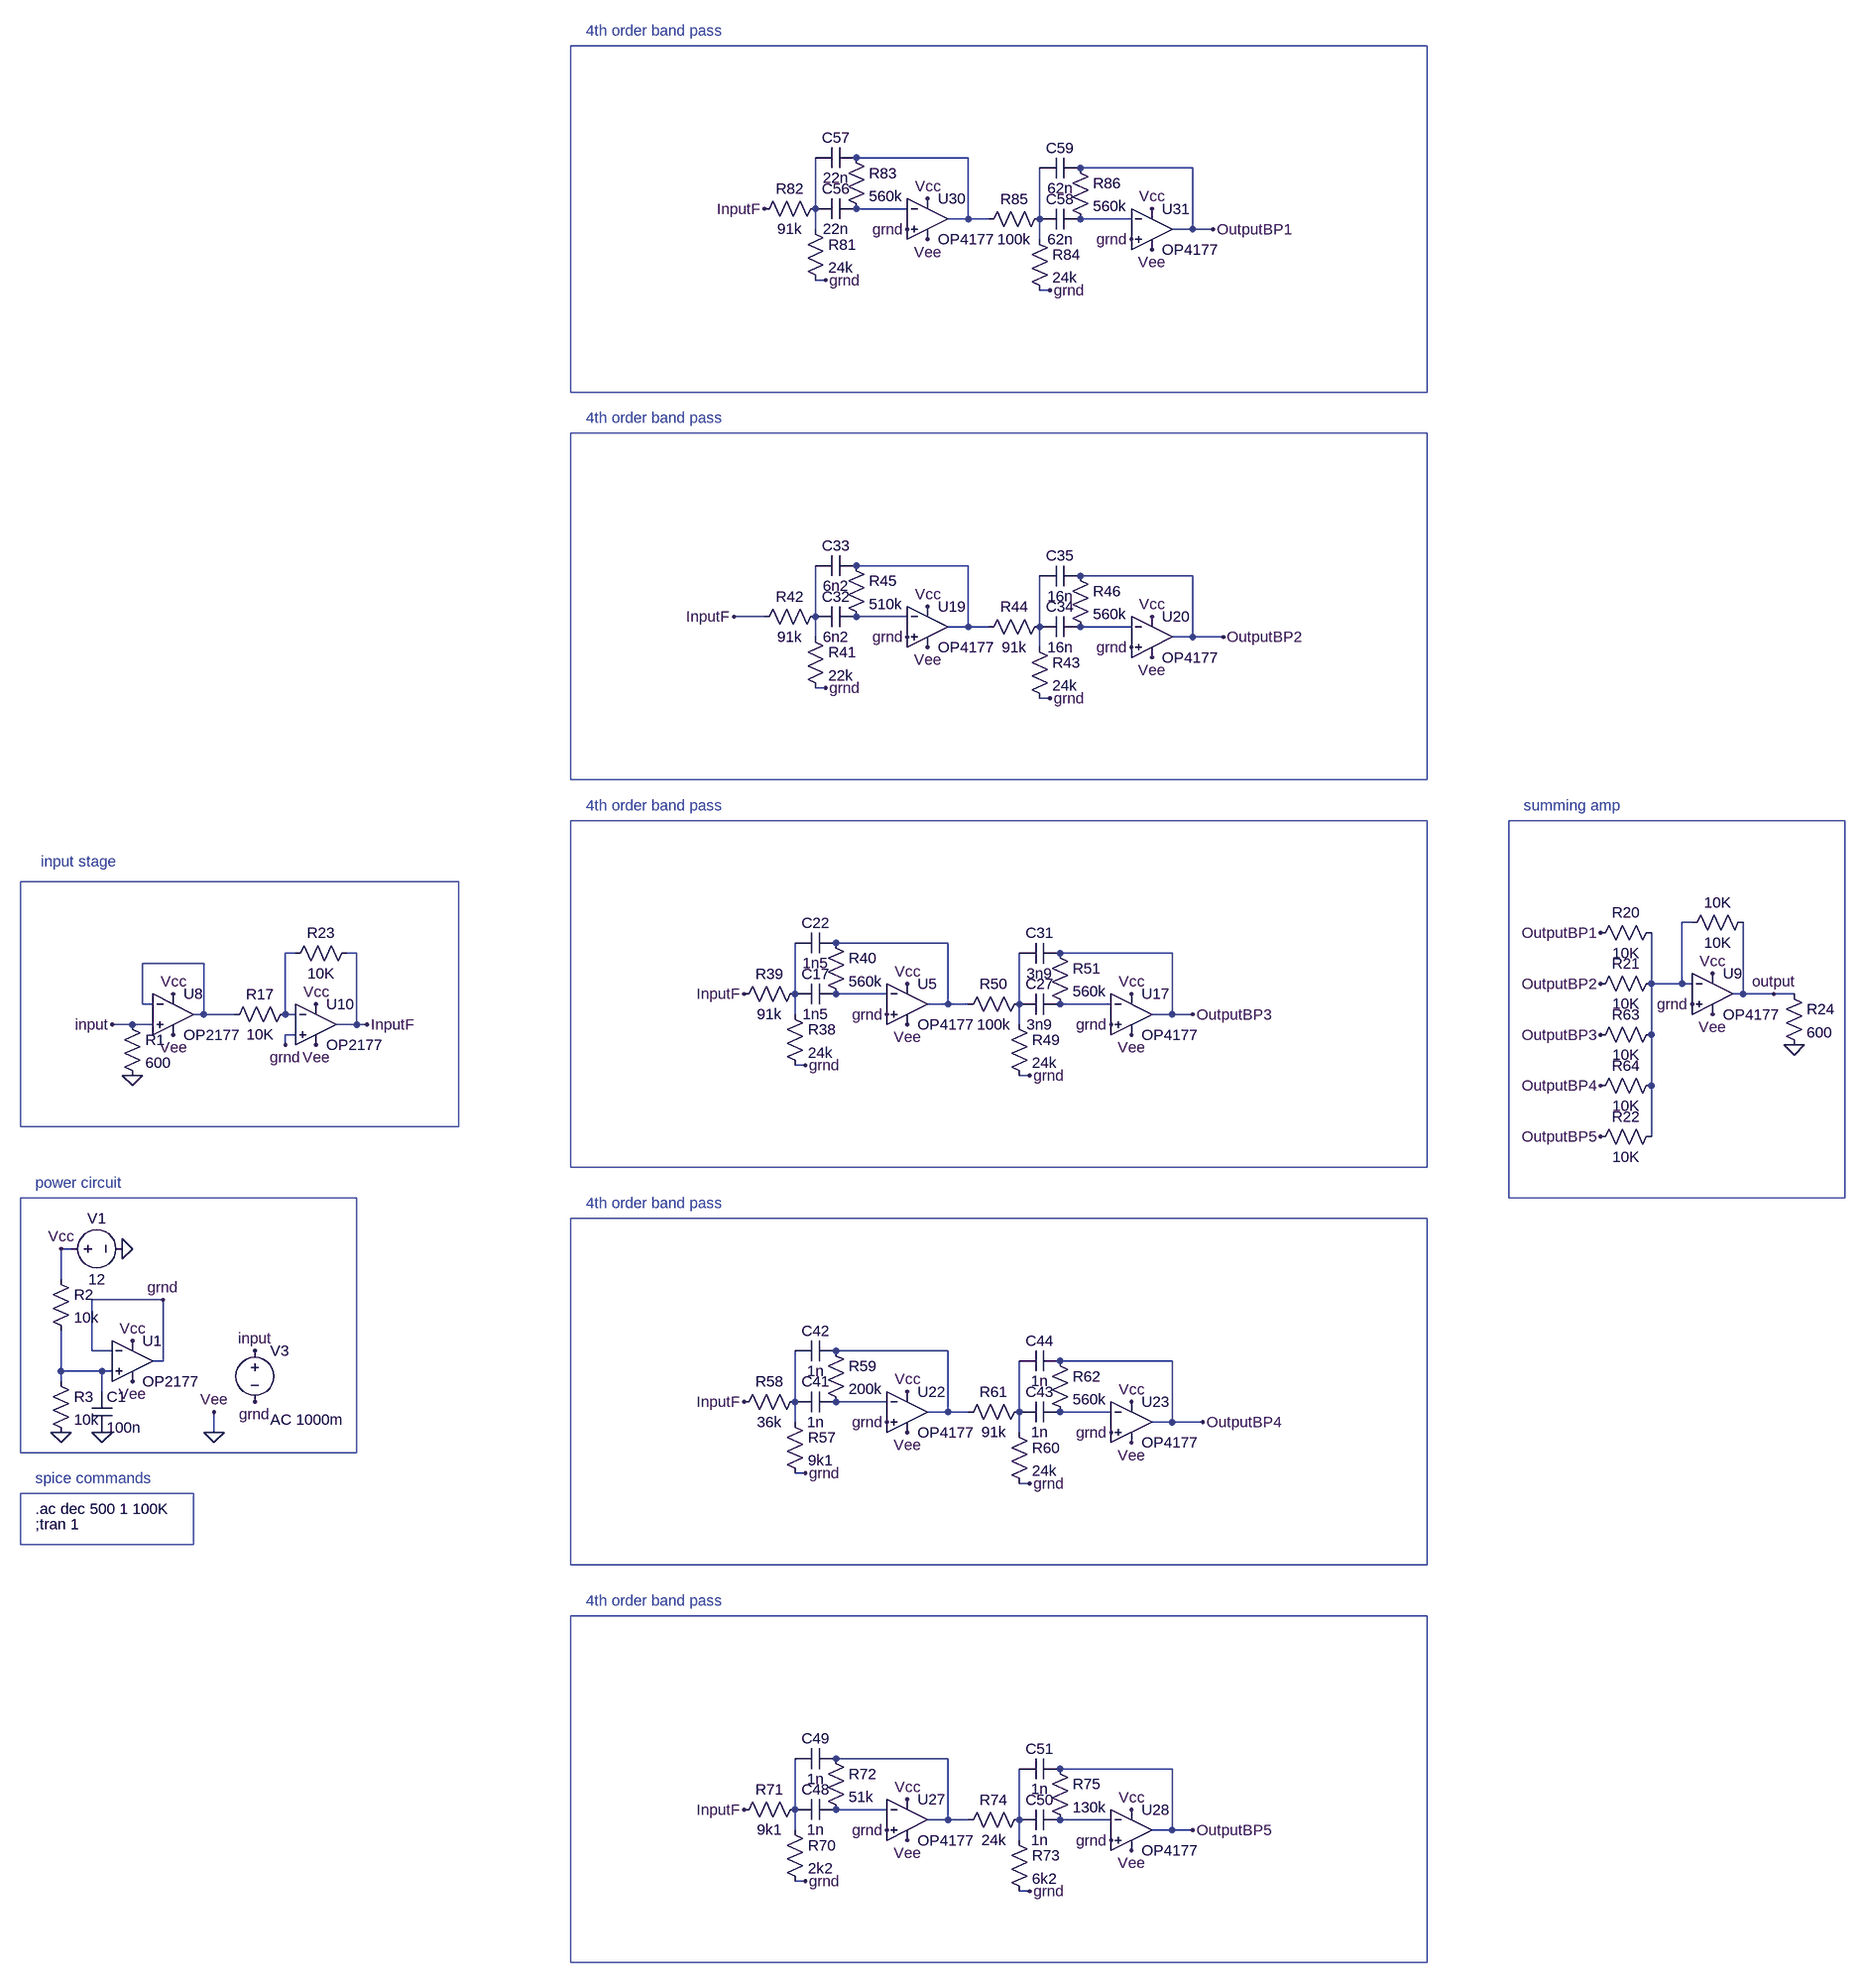
[diagram p0: schematic Filter+in&outputstage.asc]
Filter+in&outputstage.asc, the LTspice schematic file:
Version 4
SHEET 1 4112 3308
WIRE 752 -1120 576 -1120
WIRE 1104 -1104 928 -1104
WIRE 512 -1040 512 -1120
WIRE 656 -1040 576 -1040
WIRE 752 -1024 752 -1120
WIRE 752 -1024 720 -1024
WIRE 784 -1024 752 -1024
WIRE 864 -1024 864 -1104
WIRE 1008 -1024 928 -1024
WIRE 512 -1008 512 -1040
WIRE 1104 -1008 1104 -1104
WIRE 1104 -1008 1072 -1008
WIRE 1136 -1008 1104 -1008
WIRE 864 -992 864 -1024
WIRE 528 -928 512 -928
WIRE 880 -912 864 -912
WIRE 752 -480 576 -480
WIRE 1104 -464 928 -464
WIRE 432 -400 384 -400
WIRE 512 -400 512 -480
WIRE 656 -400 576 -400
WIRE 752 -384 752 -480
WIRE 752 -384 720 -384
WIRE 784 -384 752 -384
WIRE 864 -384 864 -464
WIRE 1008 -384 928 -384
WIRE 512 -368 512 -400
WIRE 1104 -368 1104 -464
WIRE 1104 -368 1072 -368
WIRE 1152 -368 1104 -368
WIRE 864 -352 864 -384
WIRE 528 -288 512 -288
WIRE 880 -272 864 -272
WIRE 1888 80 1872 80
WIRE 720 112 544 112
WIRE -304 128 -320 128
WIRE -208 128 -224 128
WIRE 1072 128 896 128
WIRE -448 144 -544 144
WIRE 1824 176 1824 96
WIRE 1872 176 1872 80
WIRE 1872 176 1824 176
WIRE 1888 176 1872 176
WIRE 480 192 480 112
WIRE 624 192 544 192
WIRE 1968 192 1968 80
WIRE 1968 192 1952 192
WIRE 2016 192 1968 192
WIRE 2048 192 2016 192
WIRE -544 208 -544 144
WIRE -528 208 -544 208
WIRE 720 208 720 112
WIRE 720 208 688 208
WIRE 752 208 720 208
WIRE 832 208 832 128
WIRE 976 208 896 208
WIRE -448 224 -448 144
WIRE -448 224 -464 224
WIRE -400 224 -448 224
WIRE -320 224 -320 128
WIRE -304 224 -320 224
WIRE 480 224 480 192
WIRE 1072 224 1072 128
WIRE 1072 224 1040 224
WIRE 1104 224 1072 224
WIRE -560 240 -592 240
WIRE -528 240 -560 240
WIRE -208 240 -208 128
WIRE -208 240 -240 240
WIRE -192 240 -208 240
WIRE 832 240 832 208
WIRE -304 256 -320 256
WIRE 1824 256 1824 176
WIRE -320 272 -320 256
WIRE 496 304 480 304
WIRE 848 320 832 320
WIRE 1824 336 1824 256
WIRE 1824 416 1824 336
WIRE -656 592 -672 592
WIRE -672 640 -672 592
WIRE -512 672 -624 672
WIRE -624 752 -624 672
WIRE -592 752 -624 752
WIRE 720 752 544 752
WIRE -512 768 -512 672
WIRE -512 768 -528 768
WIRE 1072 768 896 768
WIRE -672 784 -672 720
WIRE -608 784 -672 784
WIRE -592 784 -608 784
WIRE -672 800 -672 784
WIRE -608 816 -608 784
WIRE 480 832 480 752
WIRE 624 832 544 832
WIRE 720 848 720 752
WIRE 720 848 688 848
WIRE 752 848 720 848
WIRE 832 848 832 768
WIRE 976 848 896 848
WIRE 480 864 480 832
WIRE 1072 864 1072 768
WIRE 1072 864 1040 864
WIRE 1120 864 1072 864
WIRE -432 880 -432 848
WIRE 832 880 832 848
WIRE 496 944 480 944
WIRE 848 960 832 960
WIRE 720 1392 544 1392
WIRE 1072 1408 896 1408
WIRE 480 1472 480 1392
WIRE 624 1472 544 1472
WIRE 720 1488 720 1392
WIRE 720 1488 688 1488
WIRE 752 1488 720 1488
WIRE 832 1488 832 1408
WIRE 976 1488 896 1488
WIRE 480 1504 480 1472
WIRE 1072 1504 1072 1408
WIRE 1072 1504 1040 1504
WIRE 1104 1504 1072 1504
WIRE 832 1520 832 1488
WIRE 496 1584 480 1584
WIRE 848 1600 832 1600
FLAG -368 752 input
FLAG -592 240 input
FLAG -192 240 InputF
FLAG 1920 160 Vcc
FLAG 1920 224 Vee
FLAG 1888 208 grnd
FLAG 1744 336 OutputBP4
FLAG 2016 192 output
FLAG -272 208 Vcc
FLAG -272 272 Vee
FLAG -320 272 grnd
FLAG 2048 272 0
FLAG 1136 -1008 OutputBP1
FLAG -496 192 Vcc
FLAG -496 256 Vee
FLAG 432 -1040 InputF
FLAG 1744 96 OutputBP1
FLAG 688 -352 Vee
FLAG 528 -288 grnd
FLAG 656 -368 grnd
FLAG 688 -416 Vcc
FLAG 1040 -336 Vee
FLAG 880 -272 grnd
FLAG 1008 -352 grnd
FLAG 1040 -400 Vcc
FLAG 656 240 Vee
FLAG 496 304 grnd
FLAG 624 224 grnd
FLAG 656 176 Vcc
FLAG 1008 256 Vee
FLAG 848 320 grnd
FLAG 976 240 grnd
FLAG 1008 192 Vcc
FLAG 656 880 Vee
FLAG 496 944 grnd
FLAG 624 864 grnd
FLAG 656 816 Vcc
FLAG 1008 896 Vee
FLAG 848 960 grnd
FLAG 976 880 grnd
FLAG 1008 832 Vcc
FLAG 1744 176 OutputBP2
FLAG 1744 256 OutputBP3
FLAG 1152 -368 OutputBP2
FLAG 1104 224 OutputBP3
FLAG 1744 416 OutputBP5
FLAG 656 1520 Vee
FLAG 496 1584 grnd
FLAG 624 1504 grnd
FLAG 656 1456 Vcc
FLAG 1008 1536 Vee
FLAG 848 1600 grnd
FLAG 976 1520 grnd
FLAG 1008 1472 Vcc
FLAG 688 -992 Vee
FLAG 528 -928 grnd
FLAG 656 -1008 grnd
FLAG 688 -1056 Vcc
FLAG 1040 -976 Vee
FLAG 880 -912 grnd
FLAG 1008 -992 grnd
FLAG 1040 -1040 Vcc
FLAG -368 832 grnd
FLAG 384 -400 InputF
FLAG 400 1472 InputF
FLAG 400 832 InputF
FLAG 400 192 InputF
FLAG -560 320 0
FLAG -560 736 Vcc
FLAG -560 800 Vee
FLAG -608 880 0
FLAG -672 880 0
FLAG -432 880 0
FLAG -432 848 Vee
FLAG -512 672 grnd
FLAG -576 592 0
FLAG -672 592 Vcc
FLAG 1120 864 OutputBP4
FLAG 1104 1504 OutputBP5
SYMBOL voltage -368 736 R0
WINDOW 123 24 124 Left 2
WINDOW 39 0 0 Left 0
SYMATTR Value2 AC 1000m
SYMATTR InstName V3
SYMATTR Value ""
SYMBOL OpAmps\\OP4177 1920 128 R0
SYMATTR InstName U9
SYMBOL res 1984 64 R90
WINDOW 0 0 56 VBottom 2
WINDOW 3 32 56 VTop 2
SYMATTR InstName 10K
SYMATTR Value 10K
SYMBOL res 1840 80 R90
WINDOW 0 0 56 VBottom 2
WINDOW 3 32 56 VTop 2
SYMATTR InstName R20
SYMATTR Value 10K
SYMBOL res 1840 160 R90
WINDOW 0 0 56 VBottom 2
WINDOW 3 32 56 VTop 2
SYMATTR InstName R21
SYMATTR Value 10K
SYMBOL res 1840 400 R90
WINDOW 0 0 56 VBottom 2
WINDOW 3 32 56 VTop 2
SYMATTR InstName R22
SYMATTR Value 10K
SYMBOL OpAmps\\OP2177 -272 176 R0
SYMATTR InstName U10
SYMBOL res -304 208 R90
WINDOW 0 0 56 VBottom 2
WINDOW 3 32 56 VTop 2
SYMATTR InstName R17
SYMATTR Value 10K
SYMBOL res -208 112 R90
WINDOW 0 0 56 VBottom 2
WINDOW 3 32 56 VTop 2
SYMATTR InstName R23
SYMATTR Value 10K
SYMBOL res 2032 176 R0
SYMATTR InstName R24
SYMATTR Value 600
SYMBOL OpAmps\\OP2177 -496 160 R0
SYMATTR InstName U8
SYMBOL OpAmps\\OP4177 688 -448 R0
SYMATTR InstName U19
SYMBOL cap 576 -416 R90
WINDOW 0 0 32 VBottom 2
WINDOW 3 32 32 VTop 2
SYMATTR InstName C32
SYMATTR Value 6n2
SYMBOL cap 576 -496 R90
WINDOW 0 0 32 VBottom 2
WINDOW 3 32 32 VTop 2
SYMATTR InstName C33
SYMATTR Value 6n2
SYMBOL res 496 -384 R0
SYMATTR InstName R41
SYMATTR Value 22k
SYMBOL res 528 -416 R90
WINDOW 0 0 56 VBottom 2
WINDOW 3 32 56 VTop 2
SYMATTR InstName R42
SYMATTR Value 91k
SYMBOL res 560 -496 R0
SYMATTR InstName R45
SYMATTR Value 510k
SYMBOL OpAmps\\OP4177 1040 -432 R0
SYMATTR InstName U20
SYMBOL cap 928 -400 R90
WINDOW 0 0 32 VBottom 2
WINDOW 3 32 32 VTop 2
SYMATTR InstName C34
SYMATTR Value 16n
SYMBOL cap 928 -480 R90
WINDOW 0 0 32 VBottom 2
WINDOW 3 32 32 VTop 2
SYMATTR InstName C35
SYMATTR Value 16n
SYMBOL res 848 -368 R0
SYMATTR InstName R43
SYMATTR Value 24k
SYMBOL res 880 -400 R90
WINDOW 0 0 56 VBottom 2
WINDOW 3 32 56 VTop 2
SYMATTR InstName R44
SYMATTR Value 91k
SYMBOL res 912 -480 R0
SYMATTR InstName R46
SYMATTR Value 560k
SYMBOL OpAmps\\OP4177 656 144 R0
SYMATTR InstName U5
SYMBOL cap 544 176 R90
WINDOW 0 0 32 VBottom 2
WINDOW 3 32 32 VTop 2
SYMATTR InstName C17
SYMATTR Value 1n5
SYMBOL cap 544 96 R90
WINDOW 0 0 32 VBottom 2
WINDOW 3 32 32 VTop 2
SYMATTR InstName C22
SYMATTR Value 1n5
SYMBOL res 464 208 R0
SYMATTR InstName R38
SYMATTR Value 24k
SYMBOL res 496 176 R90
WINDOW 0 0 56 VBottom 2
WINDOW 3 32 56 VTop 2
SYMATTR InstName R39
SYMATTR Value 91k
SYMBOL res 528 96 R0
SYMATTR InstName R40
SYMATTR Value 560k
SYMBOL OpAmps\\OP4177 1008 160 R0
SYMATTR InstName U17
SYMBOL cap 896 192 R90
WINDOW 0 0 32 VBottom 2
WINDOW 3 32 32 VTop 2
SYMATTR InstName C27
SYMATTR Value 3n9
SYMBOL cap 896 112 R90
WINDOW 0 0 32 VBottom 2
WINDOW 3 32 32 VTop 2
SYMATTR InstName C31
SYMATTR Value 3n9
SYMBOL res 816 224 R0
SYMATTR InstName R49
SYMATTR Value 24k
SYMBOL res 848 192 R90
WINDOW 0 0 56 VBottom 2
WINDOW 3 32 56 VTop 2
SYMATTR InstName R50
SYMATTR Value 100k
SYMBOL res 880 112 R0
SYMATTR InstName R51
SYMATTR Value 560k
SYMBOL OpAmps\\OP4177 656 784 R0
SYMATTR InstName U22
SYMBOL cap 544 816 R90
WINDOW 0 0 32 VBottom 2
WINDOW 3 32 32 VTop 2
SYMATTR InstName C41
SYMATTR Value 1n
SYMBOL cap 544 736 R90
WINDOW 0 0 32 VBottom 2
WINDOW 3 32 32 VTop 2
SYMATTR InstName C42
SYMATTR Value 1n
SYMBOL res 464 848 R0
SYMATTR InstName R57
SYMATTR Value 9k1
SYMBOL res 496 816 R90
WINDOW 0 0 56 VBottom 2
WINDOW 3 32 56 VTop 2
SYMATTR InstName R58
SYMATTR Value 36k
SYMBOL res 528 736 R0
SYMATTR InstName R59
SYMATTR Value 200k
SYMBOL OpAmps\\OP4177 1008 800 R0
SYMATTR InstName U23
SYMBOL cap 896 832 R90
WINDOW 0 0 32 VBottom 2
WINDOW 3 32 32 VTop 2
SYMATTR InstName C43
SYMATTR Value 1n
SYMBOL cap 896 752 R90
WINDOW 0 0 32 VBottom 2
WINDOW 3 32 32 VTop 2
SYMATTR InstName C44
SYMATTR Value 1n
SYMBOL res 816 864 R0
SYMATTR InstName R60
SYMATTR Value 24k
SYMBOL res 848 832 R90
WINDOW 0 0 56 VBottom 2
WINDOW 3 32 56 VTop 2
SYMATTR InstName R61
SYMATTR Value 91k
SYMBOL res 880 752 R0
SYMATTR InstName R62
SYMATTR Value 560k
SYMBOL res 1840 240 R90
WINDOW 0 0 56 VBottom 2
WINDOW 3 32 56 VTop 2
SYMATTR InstName R63
SYMATTR Value 10K
SYMBOL res 1840 320 R90
WINDOW 0 0 56 VBottom 2
WINDOW 3 32 56 VTop 2
SYMATTR InstName R64
SYMATTR Value 10K
SYMBOL OpAmps\\OP4177 656 1424 R0
SYMATTR InstName U27
SYMBOL cap 544 1456 R90
WINDOW 0 0 32 VBottom 2
WINDOW 3 32 32 VTop 2
SYMATTR InstName C48
SYMATTR Value 1n
SYMBOL cap 544 1376 R90
WINDOW 0 0 32 VBottom 2
WINDOW 3 32 32 VTop 2
SYMATTR InstName C49
SYMATTR Value 1n
SYMBOL res 464 1488 R0
SYMATTR InstName R70
SYMATTR Value 2k2
SYMBOL res 496 1456 R90
WINDOW 0 0 56 VBottom 2
WINDOW 3 32 56 VTop 2
SYMATTR InstName R71
SYMATTR Value 9k1
SYMBOL res 528 1376 R0
SYMATTR InstName R72
SYMATTR Value 51k
SYMBOL OpAmps\\OP4177 1008 1440 R0
SYMATTR InstName U28
SYMBOL cap 896 1472 R90
WINDOW 0 0 32 VBottom 2
WINDOW 3 32 32 VTop 2
SYMATTR InstName C50
SYMATTR Value 1n
SYMBOL cap 896 1392 R90
WINDOW 0 0 32 VBottom 2
WINDOW 3 32 32 VTop 2
SYMATTR InstName C51
SYMATTR Value 1n
SYMBOL res 816 1504 R0
SYMATTR InstName R73
SYMATTR Value 6k2
SYMBOL res 848 1472 R90
WINDOW 0 0 56 VBottom 2
WINDOW 3 32 56 VTop 2
SYMATTR InstName R74
SYMATTR Value 24k
SYMBOL res 880 1392 R0
SYMATTR InstName R75
SYMATTR Value 130k
SYMBOL OpAmps\\OP4177 688 -1088 R0
SYMATTR InstName U30
SYMBOL cap 576 -1056 R90
WINDOW 0 0 32 VBottom 2
WINDOW 3 32 32 VTop 2
SYMATTR InstName C56
SYMATTR Value 22n
SYMBOL cap 576 -1136 R90
WINDOW 0 0 32 VBottom 2
WINDOW 3 32 32 VTop 2
SYMATTR InstName C57
SYMATTR Value 22n
SYMBOL res 496 -1024 R0
SYMATTR InstName R81
SYMATTR Value 24k
SYMBOL res 528 -1056 R90
WINDOW 0 0 56 VBottom 2
WINDOW 3 32 56 VTop 2
SYMATTR InstName R82
SYMATTR Value 91k
SYMBOL res 560 -1136 R0
SYMATTR InstName R83
SYMATTR Value 560k
SYMBOL OpAmps\\OP4177 1040 -1072 R0
SYMATTR InstName U31
SYMBOL cap 928 -1040 R90
WINDOW 0 0 32 VBottom 2
WINDOW 3 32 32 VTop 2
SYMATTR InstName C58
SYMATTR Value 62n
SYMBOL cap 928 -1120 R90
WINDOW 0 0 32 VBottom 2
WINDOW 3 32 32 VTop 2
SYMATTR InstName C59
SYMATTR Value 62n
SYMBOL res 848 -1008 R0
SYMATTR InstName R84
SYMATTR Value 24k
SYMBOL res 880 -1040 R90
WINDOW 0 0 56 VBottom 2
WINDOW 3 32 56 VTop 2
SYMATTR InstName R85
SYMATTR Value 100k
SYMBOL res 912 -1120 R0
SYMATTR InstName R86
SYMATTR Value 560k
SYMBOL res -576 224 R0
SYMATTR InstName R1
SYMATTR Value 600
SYMBOL OpAmps\\OP2177 -560 704 R0
SYMATTR InstName U1
SYMBOL res -688 624 R0
SYMATTR InstName R2
SYMATTR Value 10k
SYMBOL res -688 784 R0
SYMATTR InstName R3
SYMATTR Value 10k
SYMBOL cap -624 816 R0
SYMATTR InstName C1
SYMATTR Value 100n
SYMBOL voltage -672 592 R270
WINDOW 0 32 56 VTop 2
WINDOW 3 -32 56 VBottom 2
WINDOW 123 0 0 Left 0
WINDOW 39 0 0 Left 0
SYMATTR InstName V1
SYMATTR Value 12
TEXT -712 1000 Left 2 !.ac dec 500 1 100K
TEXT -712 1024 Left 2 !;tran 1
TEXT -704 -16 Left 2 ;input stage
TEXT 152 -712 Left 2 ;4th order band pass
TEXT 1624 -104 Left 2 ;summing amp
TEXT -712 488 Left 2 ;power circuit
TEXT -712 952 Left 2 ;spice commands
TEXT 152 -104 Left 2 ;4th order band pass
TEXT 152 520 Left 2 ;4th order band pass
TEXT 152 1144 Left 2 ;4th order band pass
TEXT 152 -1320 Left 2 ;4th order band pass
RECTANGLE Normal 1472 -144 128 -688
RECTANGLE Normal -464 1056 -736 976
RECTANGLE Normal 1472 464 128 -80
RECTANGLE Normal 1472 1088 128 544
RECTANGLE Normal 1472 1712 128 1168
RECTANGLE Normal 2128 512 1600 -80
RECTANGLE Normal 1472 -752 128 -1296
RECTANGLE Normal -48 400 -736 16
RECTANGLE Normal -208 512 -736 912

The netlist it stands for:
* Filter+in&outputstage.asc
V3 input grnd AC 1000m
XU9 grnd N011 Vcc 0 output OP4177  ; pins In+ In- V+ V- OUT
R§10K output N011 10K
R20 N011 OutputBP1 10K
R21 N011 OutputBP2 10K
R22 N011 OutputBP5 10K
XU10 grnd N013 Vcc 0 InputF OP2177  ; pins In+ In- V+ V- OUT
R17 N013 N014 10K
R23 InputF N013 10K
R24 output 0 600
XU8 input N014 Vcc 0 N014 OP2177  ; pins In+ In- V+ V- OUT
XU19 grnd N008 Vcc 0 N006 OP4177  ; pins In+ In- V+ V- OUT
C32 N008 N007 6n2
C33 N006 N007 6n2
R41 N007 grnd 22k
R42 N007 InputF 91k
R45 N006 N008 510k
XU20 grnd N010 Vcc 0 OutputBP2 OP4177  ; pins In+ In- V+ V- OUT
C34 N010 N009 16n
C35 OutputBP2 N009 16n
R43 N009 grnd 24k
R44 N009 N006 91k
R46 OutputBP2 N010 560k
XU5 grnd N016 Vcc 0 N012 OP4177  ; pins In+ In- V+ V- OUT
C17 N016 N015 1n5
C22 N012 N015 1n5
R38 N015 grnd 24k
R39 N015 InputF 91k
R40 N012 N016 560k
XU17 grnd N018 Vcc 0 OutputBP3 OP4177  ; pins In+ In- V+ V- OUT
C27 N018 N017 3n9
C31 OutputBP3 N017 3n9
R49 N017 grnd 24k
R50 N017 N012 100k
R51 OutputBP3 N018 560k
XU22 grnd N022 Vcc 0 N019 OP4177  ; pins In+ In- V+ V- OUT
C41 N022 N021 1n
C42 N019 N021 1n
R57 N021 grnd 9k1
R58 N021 InputF 36k
R59 N019 N022 200k
XU23 grnd N024 Vcc 0 OutputBP4 OP4177  ; pins In+ In- V+ V- OUT
C43 N024 N023 1n
C44 OutputBP4 N023 1n
R60 N023 grnd 24k
R61 N023 N019 91k
R62 OutputBP4 N024 560k
R63 N011 OutputBP3 10K
R64 N011 OutputBP4 10K
XU27 grnd N027 Vcc 0 N025 OP4177  ; pins In+ In- V+ V- OUT
C48 N027 N026 1n
C49 N025 N026 1n
R70 N026 grnd 2k2
R71 N026 InputF 9k1
R72 N025 N027 51k
XU28 grnd N029 Vcc 0 OutputBP5 OP4177  ; pins In+ In- V+ V- OUT
C50 N029 N028 1n
C51 OutputBP5 N028 1n
R73 N028 grnd 6k2
R74 N028 N025 24k
R75 OutputBP5 N029 130k
XU30 grnd N003 Vcc 0 N001 OP4177  ; pins In+ In- V+ V- OUT
C56 N003 N002 22n
C57 N001 N002 22n
R81 N002 grnd 24k
R82 N002 InputF 91k
R83 N001 N003 560k
XU31 grnd N005 Vcc 0 OutputBP1 OP4177  ; pins In+ In- V+ V- OUT
C58 N005 N004 62n
C59 OutputBP1 N004 62n
R84 N004 grnd 24k
R85 N004 N001 100k
R86 OutputBP1 N005 560k
R1 input 0 600
XU1 N020 grnd Vcc 0 grnd OP2177  ; pins In+ In- V+ V- OUT
R2 Vcc N020 10k
R3 N020 0 10k
C1 N020 0 100n
V1 Vcc 0 12
.ac dec 500 1 100K
;tran 1
* input stage
* 4th order band pass
* summing amp
* power circuit
* spice commands
* 4th order band pass
* 4th order band pass
* 4th order band pass
* 4th order band pass
.backanno
.end